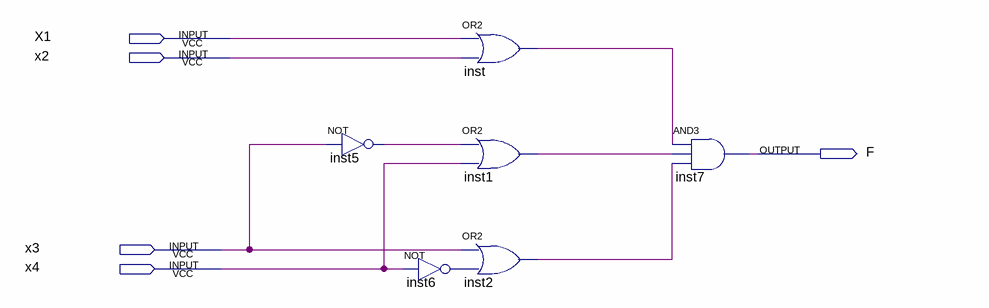
[diagram p0: schematic sheet]
// Quartus schematic Exercise_2.bdf as structural Verilog: 6 symbols, 5 pins
module Exercise_2 (
  input  X1,
  input  x2,
  input  x3,
  input  x4,
  output F
);

  wire inst1_out, inst2_out, inst5_out, inst6_out, inst_out;

  not inst5 (inst5_out, x3);
  or inst (inst_out, X1, x2);
  or inst1 (inst1_out, inst5_out, x4);
  or inst2 (inst2_out, x3, inst6_out);
  not inst6 (inst6_out, x4);
  and inst7 (F, inst_out, inst1_out, inst2_out);
endmodule
